# EAGLE design cr2032_powered_devel_board (EAGLE 6.5.0)
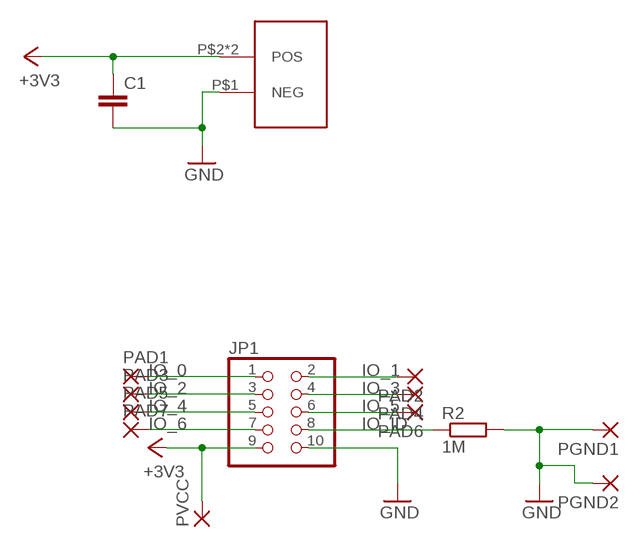
[diagram p0: schematic, sheet 1]

## Parts
C1  C-EU025-030X050  [C025-030X050]
JP1  PINHD-2X5  [2X05]
PAD1  1,6/0,8  [1,6/0,8]
PAD2  1,6/0,8  [1,6/0,8]
PAD3  1,6/0,8  [1,6/0,8]
PAD4  1,6/0,8  [1,6/0,8]
PAD5  1,6/0,8  [1,6/0,8]
PAD6  1,6/0,8  [1,6/0,8]
PAD7  1,6/0,8  [1,6/0,8]
PGND1  1,6/0,8  [1,6/0,8]
PGND2  1,6/0,8  [1,6/0,8]
PVCC  1,6/0,8  [1,6/0,8]
R2  1M  R-EU_R0402  [R0402]
U$1  CR2032_CLIP  [CR2032_CLIP]

## Nets
+3V3: C1.1 JP1.9 PVCC.1(P) U$1.P$2(POS) U$1.P$3(POS)
GND: C1.2 JP1.10 PGND1.1(P) PGND2.1(P) R2.2 U$1.P$1(NEG)
IO_0: JP1.1 PAD1.1(P)
IO_1: JP1.2 PAD2.1(P)
IO_2: JP1.3 PAD3.1(P)
IO_3: JP1.4 PAD4.1(P)
IO_4: JP1.5 PAD5.1(P)
IO_5: JP1.6 PAD6.1(P)
IO_6: JP1.7 PAD7.1(P)
IO_ID: JP1.8 R2.1

## Library data of the parts
C1 = rcl:C-EU: CAPACITOR, European symbol; DIGIKEY: BK-913-ND
JP1 = pinhead:PINHD-2X5: PIN HEADER; DIGIKEY: S6105-ND
PAD1-PAD7 PGND1 PGND2 PVCC = wirepad:1,6/0,8: THROUGH-HOLE PAD
R2 = rcl:R-EU_: RESISTOR, European symbol; DIGIKEY: 311-1.00MLRCT-ND
U$1 = cr2032_clip:CR2032_CLIP; DIGIKEY: BK-913-ND

## Board
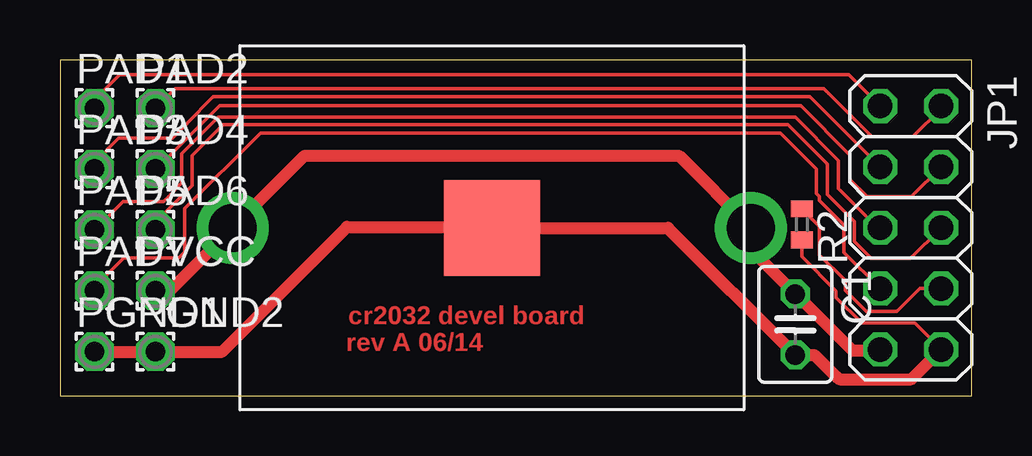
[diagram p1: board, top side]
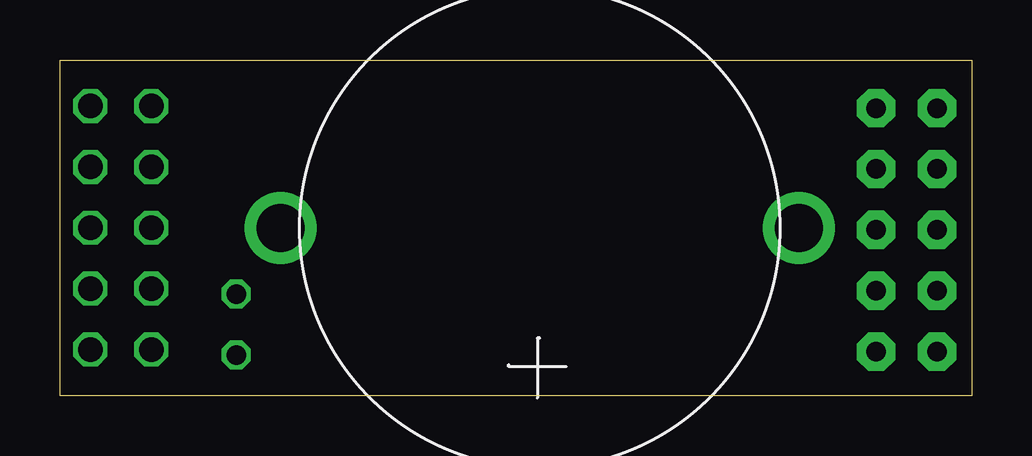
[diagram p2: board, bottom side, seen from below]

Size 38 x 14 mm. Coordinates in mm from the lower left corner, seen from the top.
Outline: 0,0 38,0 38,14 0,14 0,0
Copper layers (1*16): Top 0.035mm / dielectric 1.5mm / Bottom 0.035mm
Design rules "PCB-POOL Standard": minimum track width 0.15mm, minimum drill 0.3mm, track to track 0.15mm, track to pad 0.15mm, pad to pad 0.15mm, via to via 0.15mm, smd to smd 0.15mm, copper to edge 0.3mm, drill to drill 0.2mm, minimum pad ring 0.2mm, minimum via ring 0.15mm, stop-mask expansion 0.075mm, vias tented up to drill 0mil, thermal gap 0.2mm

### Footprints (pad centres in the part's own frame; a part is rotated, then mirrored left to right if it is on the bottom)
C025-030X050 = drill 0.813 octagon: 1 -1.27,0; 2 1.27,0
2X05 = drill 1.016 octagon: 1 -5.08,-1.27; 2 -5.08,1.27; 3 -2.54,-1.27; 4 -2.54,1.27; 5 0,-1.27; 6 0,1.27; 7 2.54,-1.27; 8 2.54,1.27; 9 5.08,-1.27; 10 5.08,1.27
1,6/0,8 = drill 0.813 pad 1.6 octagon: 1 0,0
R0402 = smd 0.7 x 0.9: 1 -0.65,0; 2 0.65,0
CR2032_CLIP = smd 4 x 4: P$1 0,0 | drill 2 pad 3: P$2 -10.8,0; P$3 10.8,0

### Placement (x,y rotation side)
C1  30.65,2.97 270 top
JP1  35.46,7 270 top
PAD1  1.44,11.99 0 top
PAD2  3.98,11.99 0 top
PAD3  1.44,9.45 0 top
PAD4  3.98,9.45 0 top
PAD5  1.44,6.91 0 top
PAD6  3.98,6.91 0 top
PAD7  1.44,4.37 0 top
PGND1  1.44,1.83 0 top
PGND2  3.98,1.83 0 top
PVCC  3.98,4.37 0 top
R2  30.93,7.14 270 top
U$1  18,7 0 top

### Tracks (layer width: path | path; a pad name or v marks a point on that pad's centre or on a via)
+3V3
  Top 0.508: JP1.9 34.15,1.88 33.04,1.88 30.68,4.24 C1.1 28.8,6.09 U$1.P$3 25.79,10.01 10.2,10.01 U$1.P$2 4.57,4.37 PVCC.1
GND
  Top 0.152: R2.2 30.93,5.8 32.35,4.37 32.35,4.09 33.42,3.02 35.63,3.02 JP1.10
  Top 0.508: PGND1.1 PGND2.1 6.76,1.83 11.96,7.04 17.96,7.04 U$1.P$1 25.35,7 C1.2 31.44,1.7 32.38,0.76 32.4,0.76 32.48,0.69 35.5,0.69 JP1.10
IO_0
  Top 0.152: PAD1.1 1.44,12.34 2.48,13.39 32.88,13.39 JP1.1
IO_1
  Top 0.152: JP1.2 36.73,11.97 35.55,10.79 33.85,10.79 31.84,12.8 4.79,12.8 PAD2.1
IO_2
  Top 0.152: PAD3.1 1.44,9.73 2.46,10.74 4.69,10.74 5.28,11.33 5.28,11.35 6.39,12.47 31.26,12.47 JP1.3
IO_3
  Top 0.152: PAD4.1 4.01,9.45 6.65,12.09 30.88,12.09 32.94,10.03 32.94,9.02 33.65,8.31 35.5,8.31 JP1.4
IO_4
  Top 0.152: JP1.5 34.09,7 32.45,8.64 32.45,9.8 30.65,11.61 6.6,11.61 5.08,10.08 5.08,8.87 4.32,8.1 2.63,8.1 PAD5.1
IO_5
  Top 0.152: PAD6.1 4.13,6.91 4.13,7.38 5.51,8.76 5.51,10.01 6.81,11.3 30.35,11.3 32,9.65 32,8.38 33.11,7.26 33.11,6.43 33.83,5.71 35.45,5.71 JP1.6
IO_6
  Top 0.152: PAD7.1 1.44,4.52 2.66,5.74 4.95,5.74 5.21,5.99 5.21,7.8 8.36,10.95 30.04,10.95 31.54,9.45 31.54,8.43 31.67,8.31 31.67,8.13 32.68,7.11 32.68,5.97 JP1.7
IO_ID
  Top 0.152: JP1.8 35.85,4.46 34.89,3.5 33.62,3.5 32.73,4.39 32.73,4.8 31.67,5.87 31.67,7.05 R2.1

### Text on the board
Top: cr2032 devel board | rev A 06/14
tDocu: FEMALE / BOTTOM